# EAGLE schematic ControllerV6 (EAGLE 9.6.2)

## Sheet 1 of 2
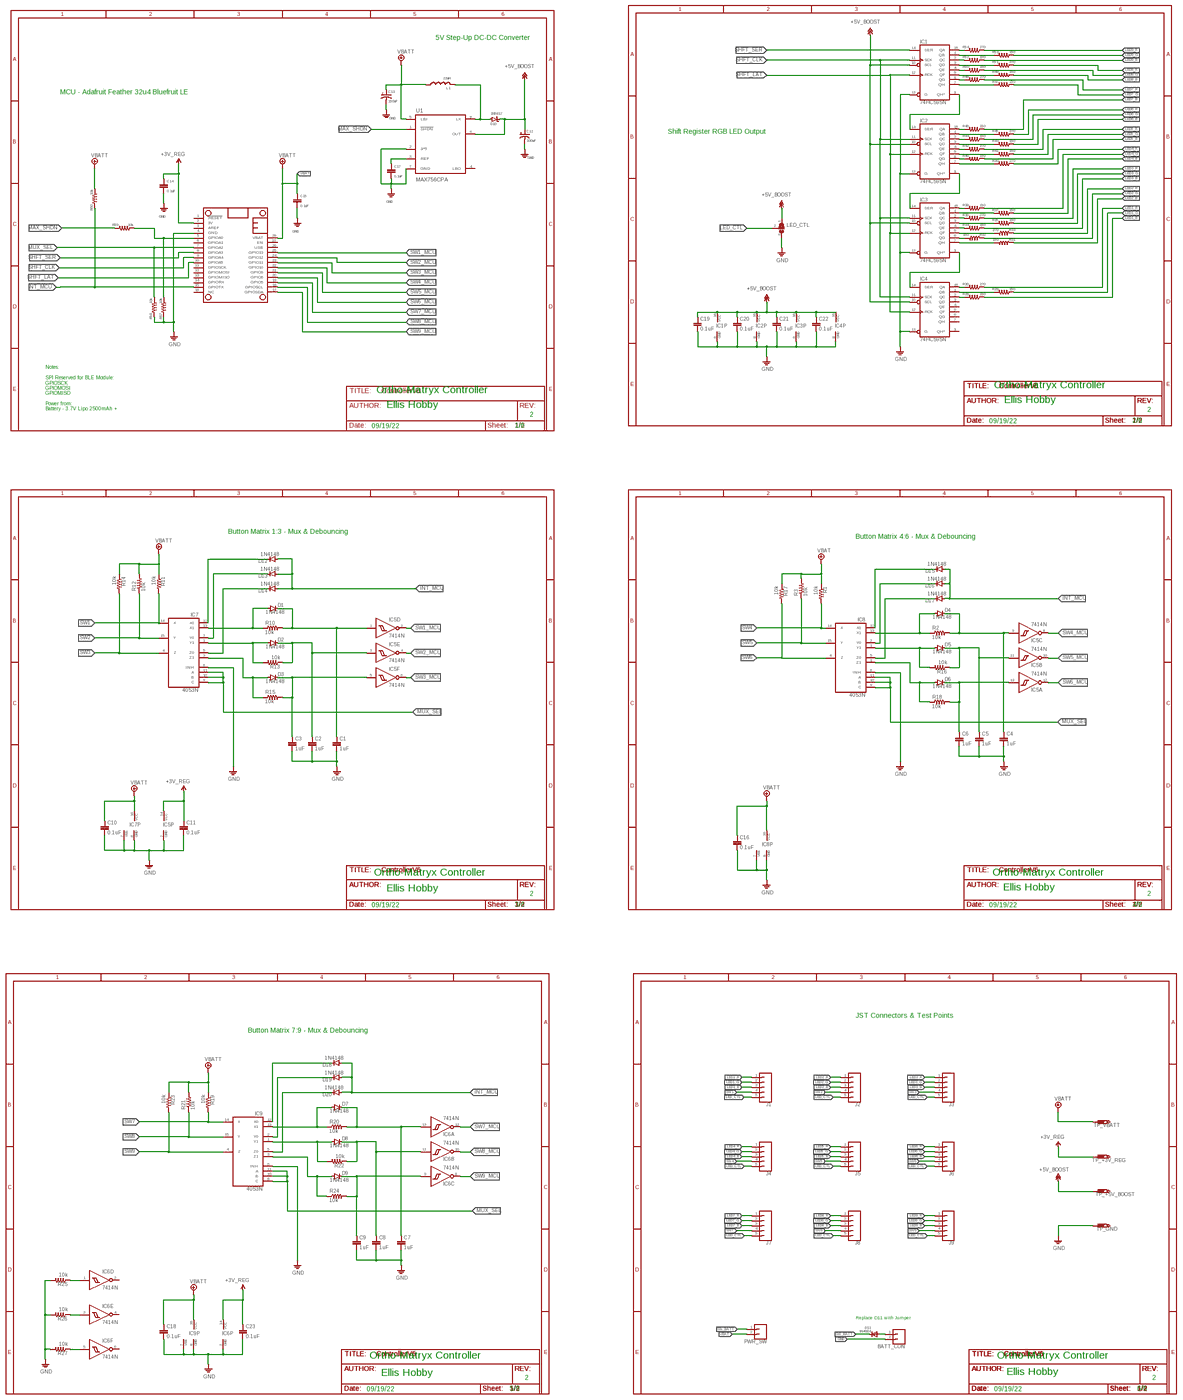
[diagram p0: schematic, sheet 1, overview]
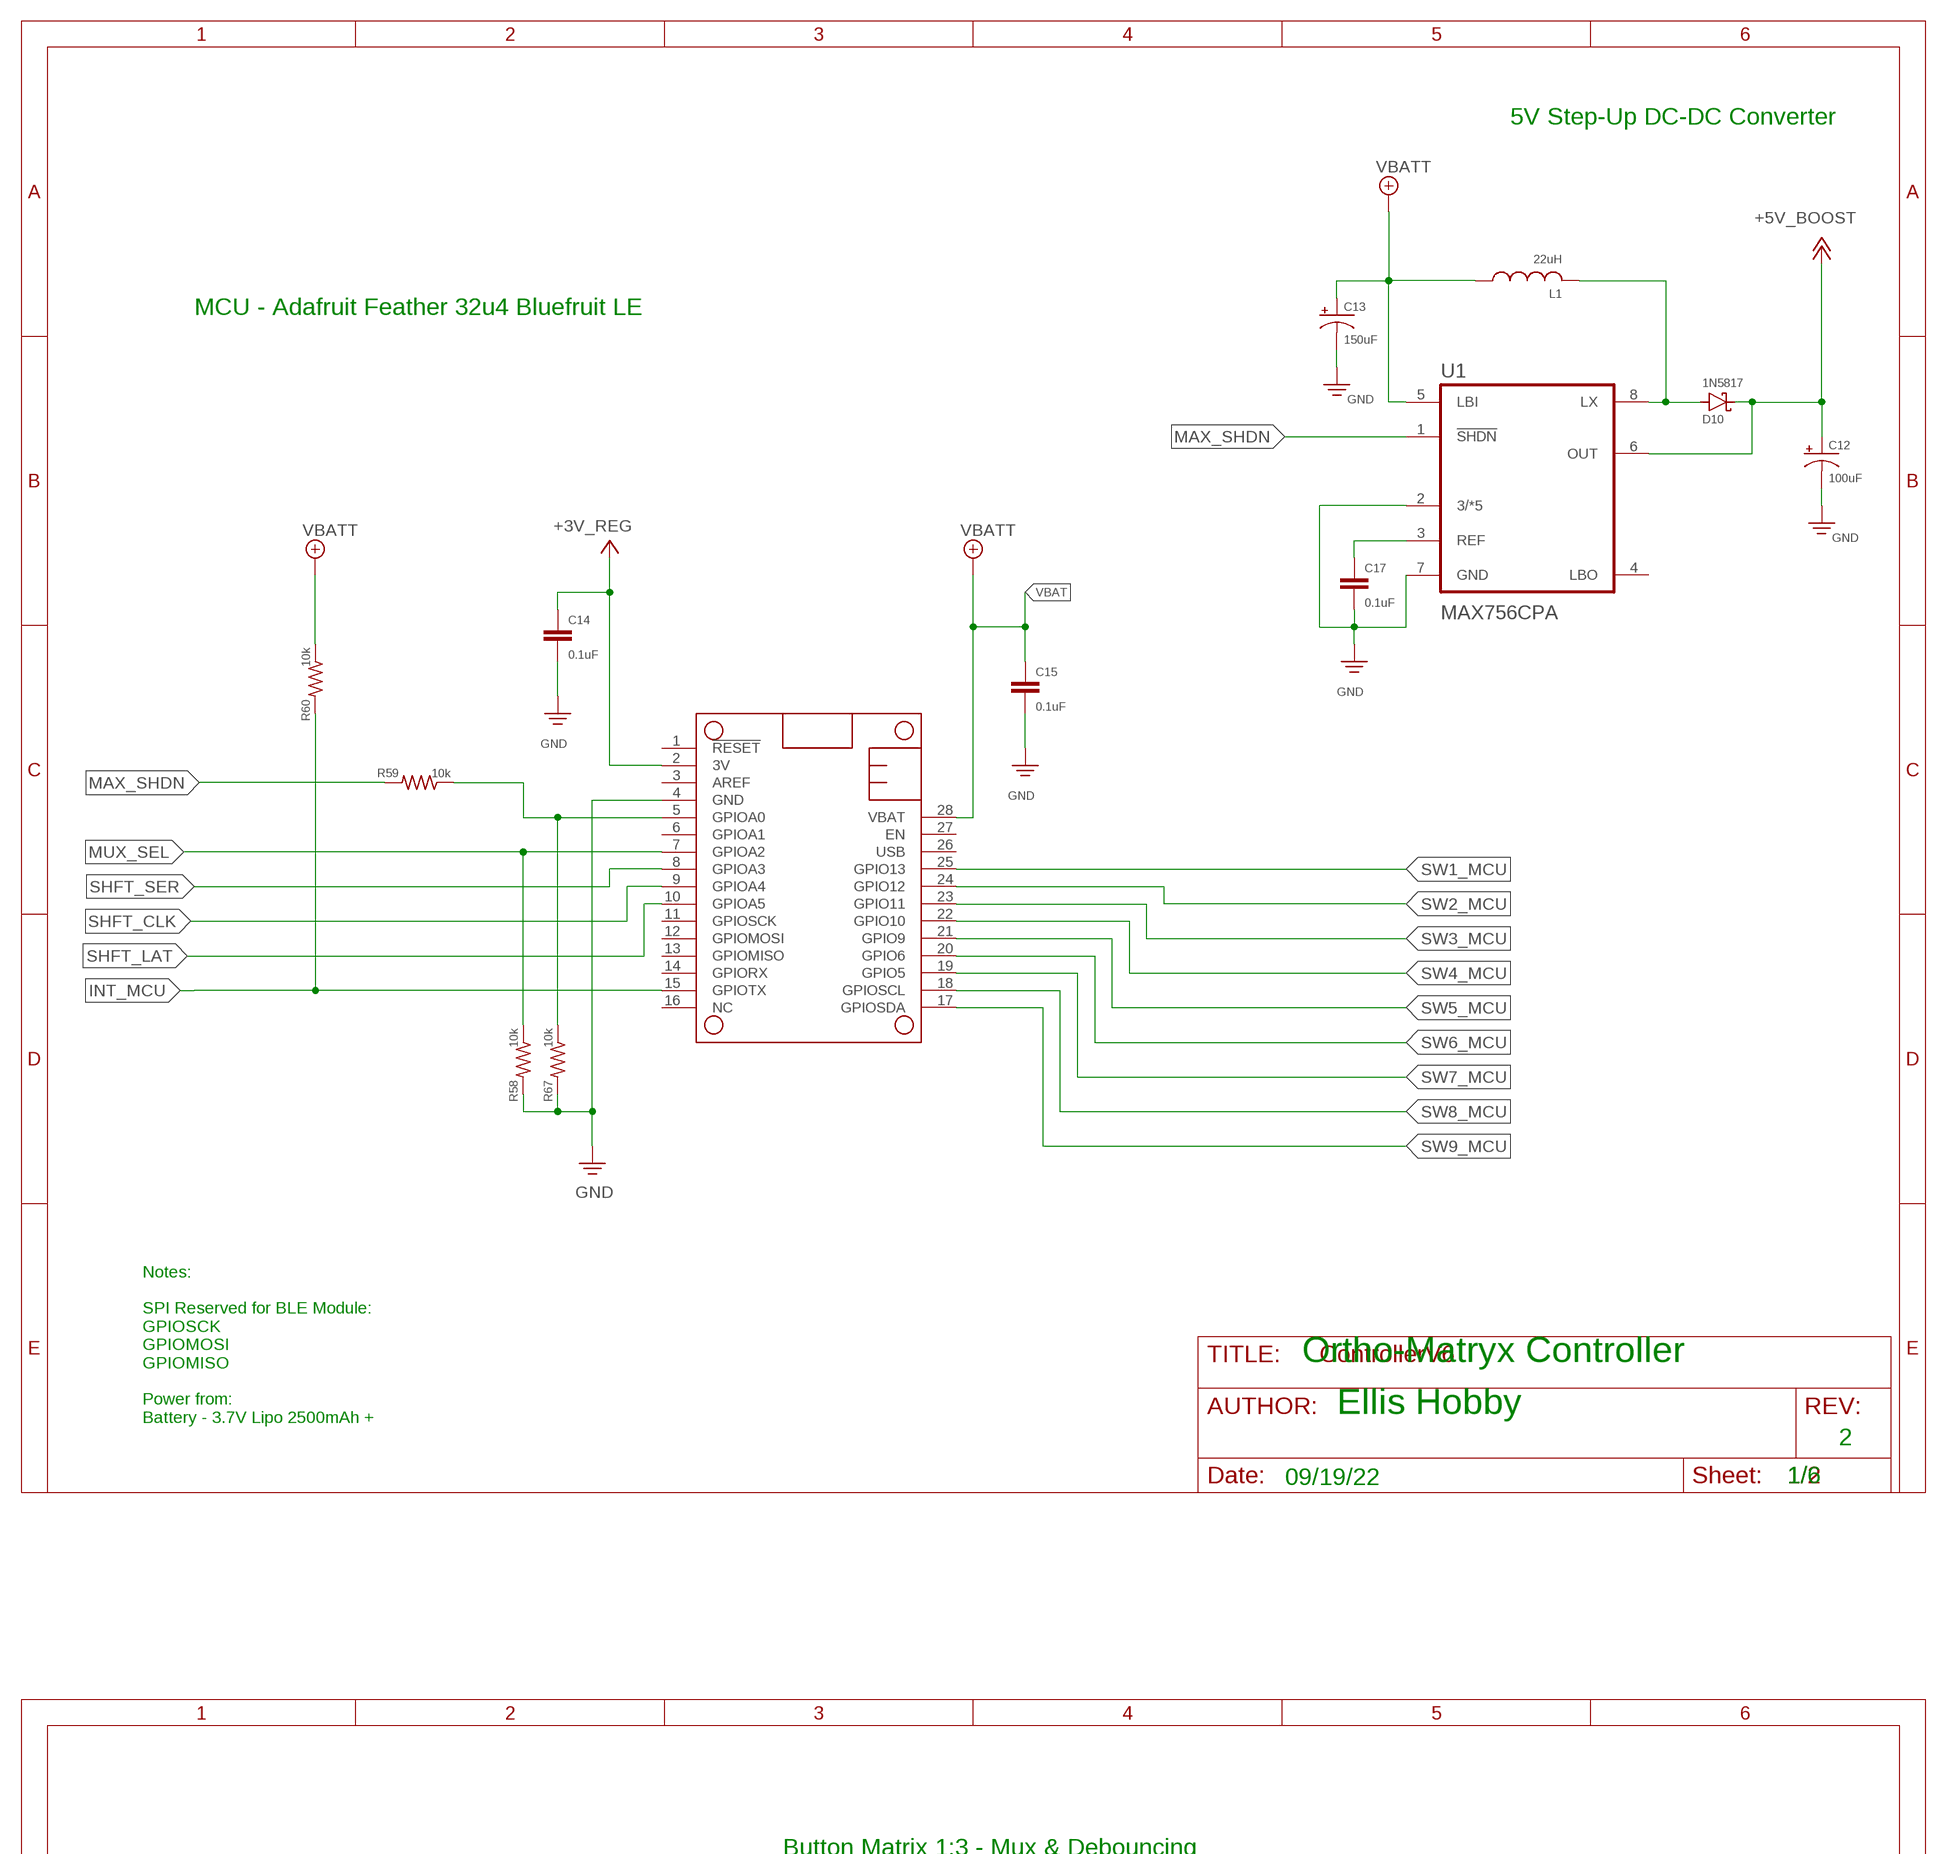
[diagram p1: schematic, sheet 1, part 1 of 4]
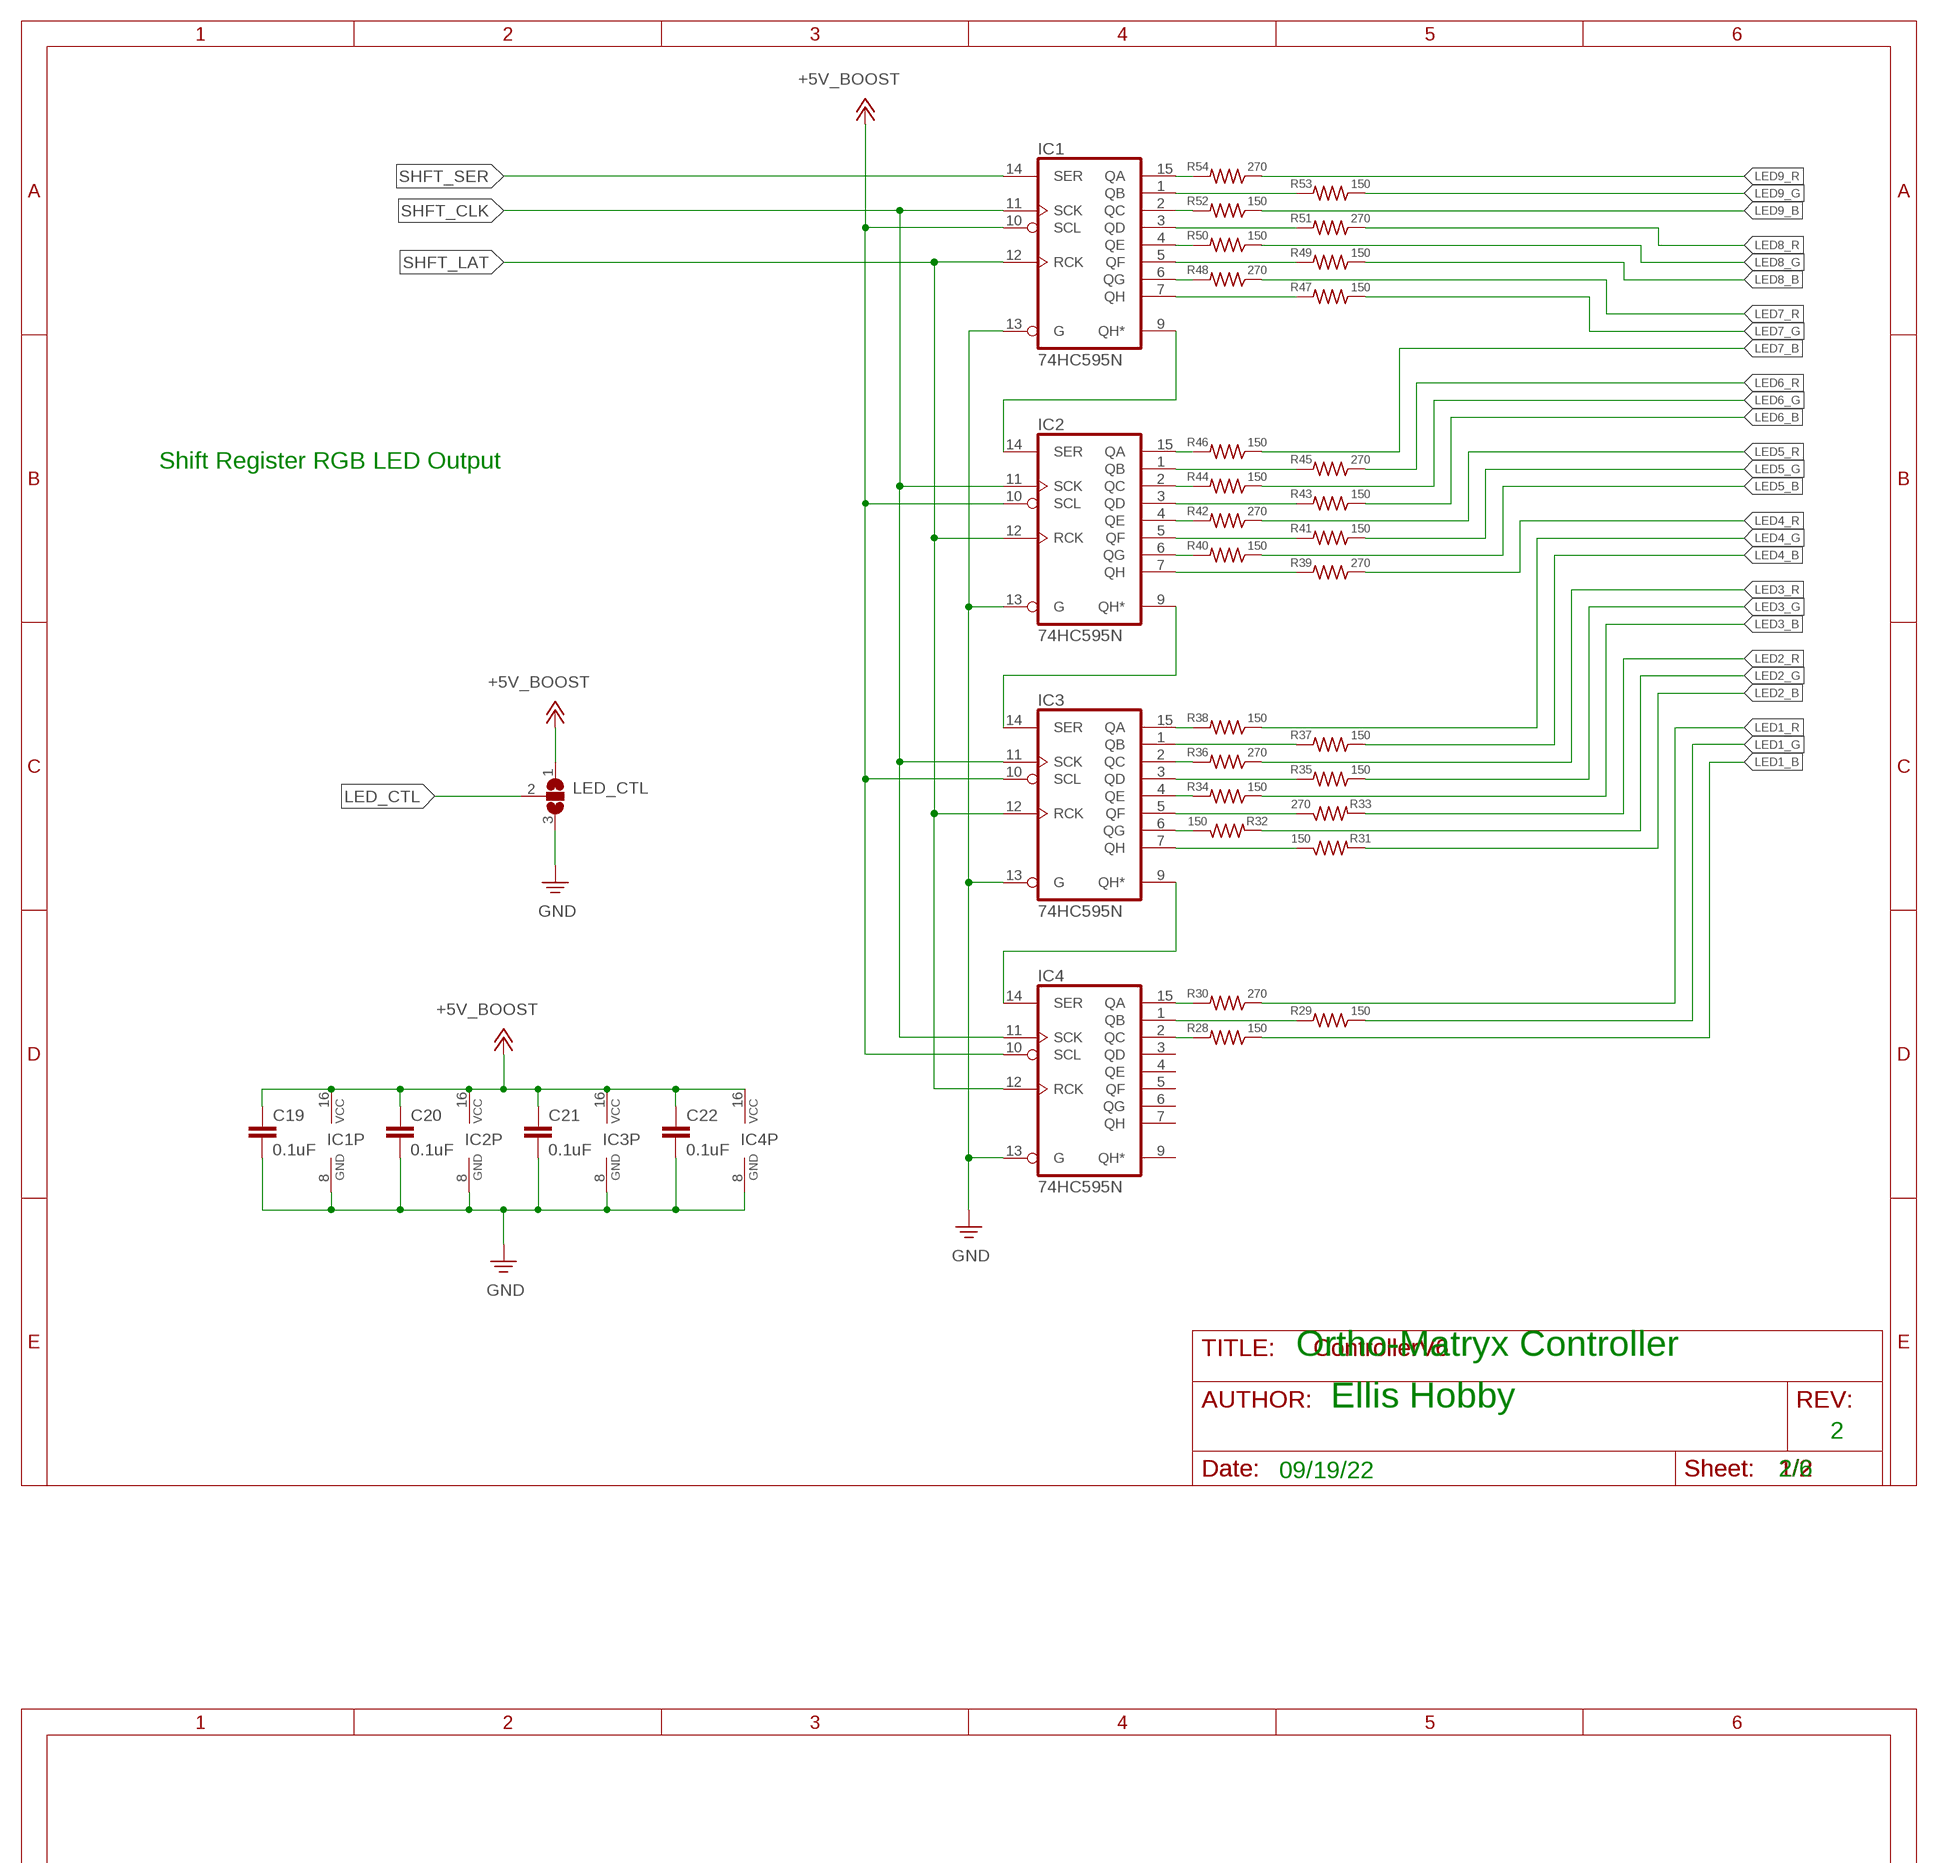
[diagram p2: schematic, sheet 1, part 2 of 4]
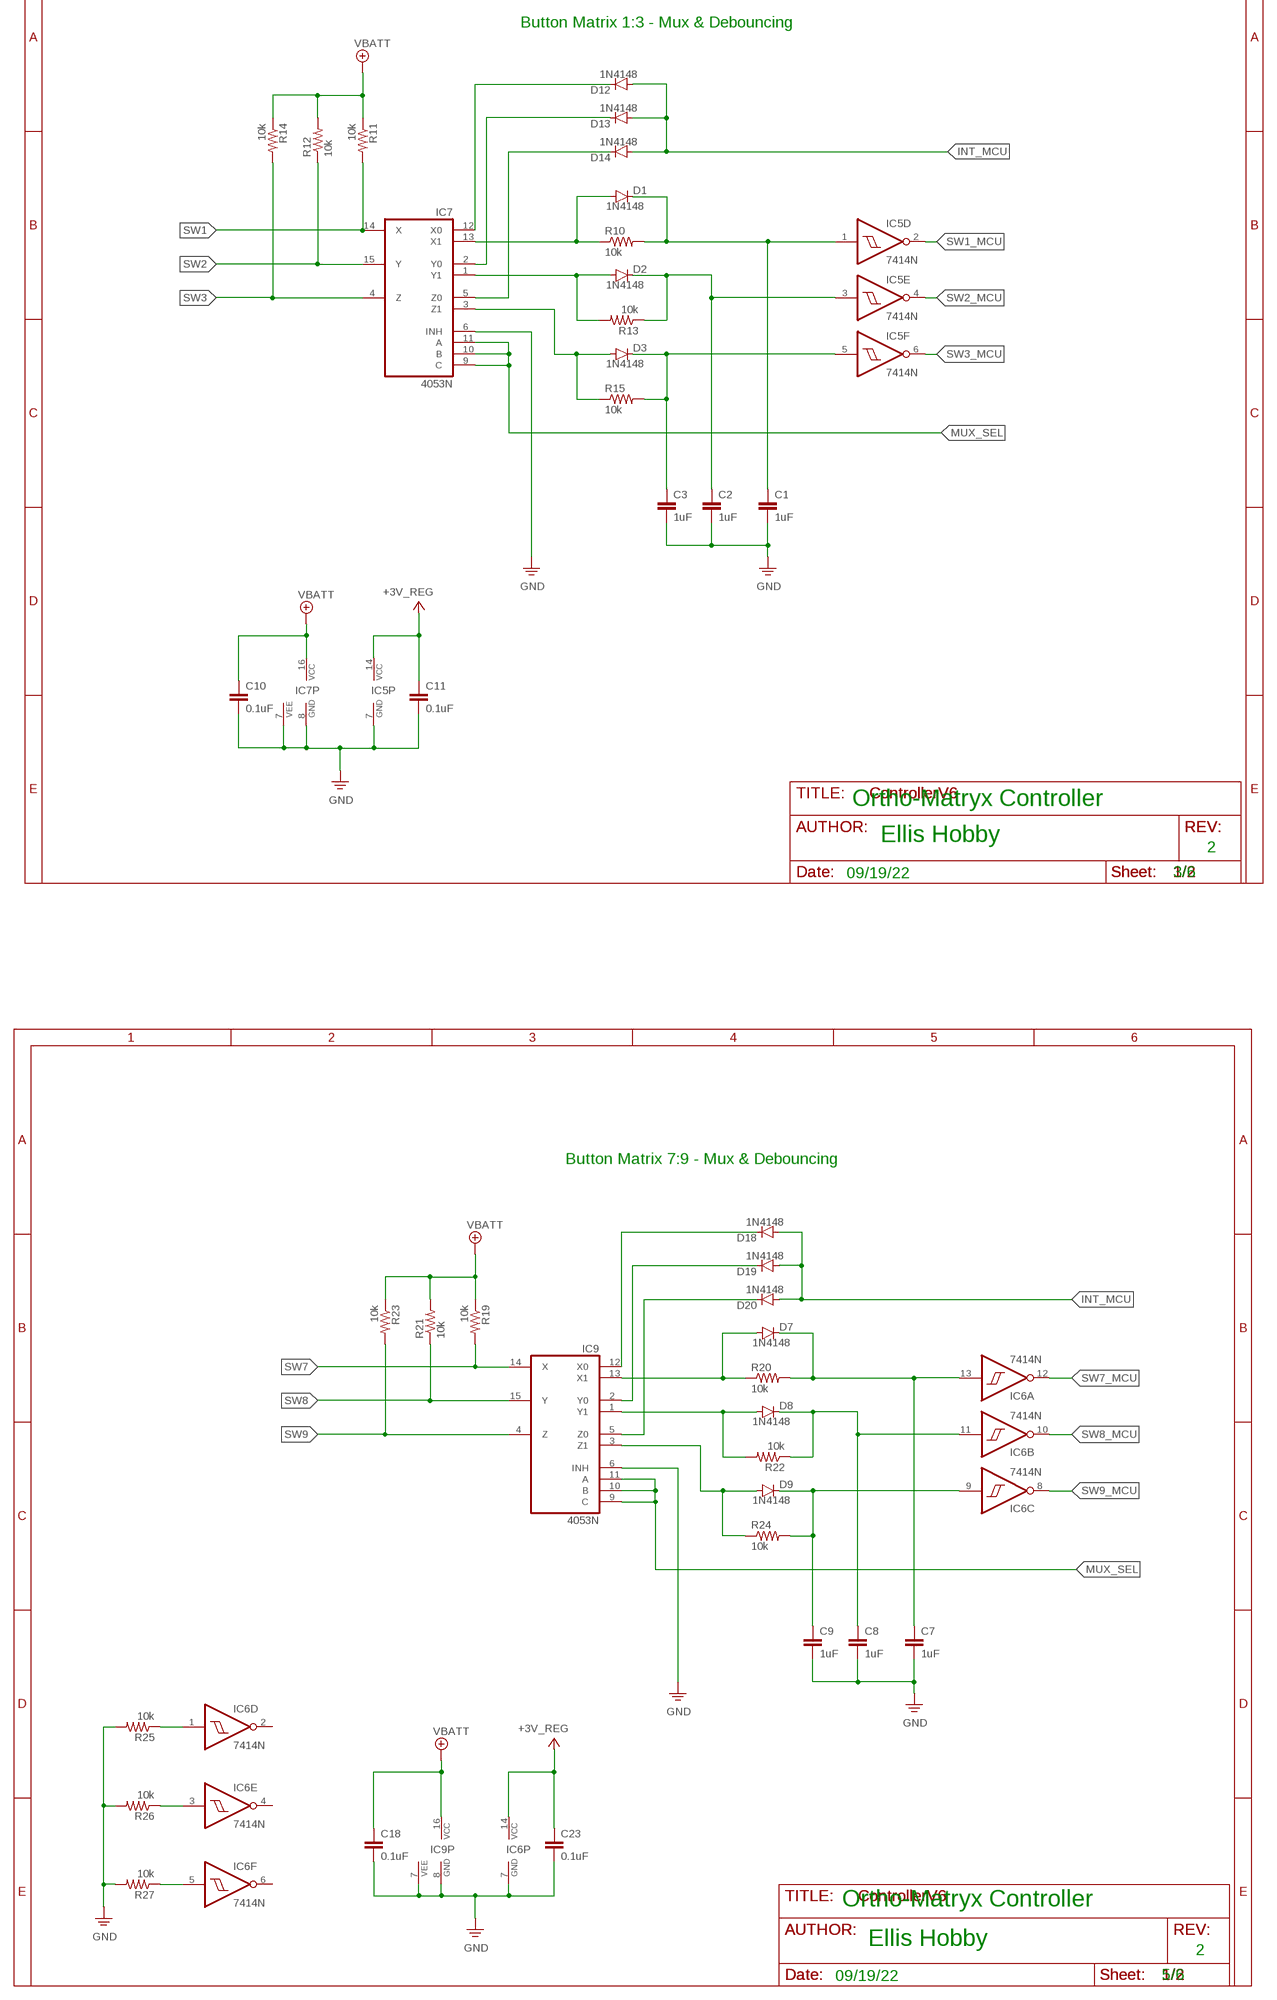
[diagram p3: schematic, sheet 1, part 3 of 4]
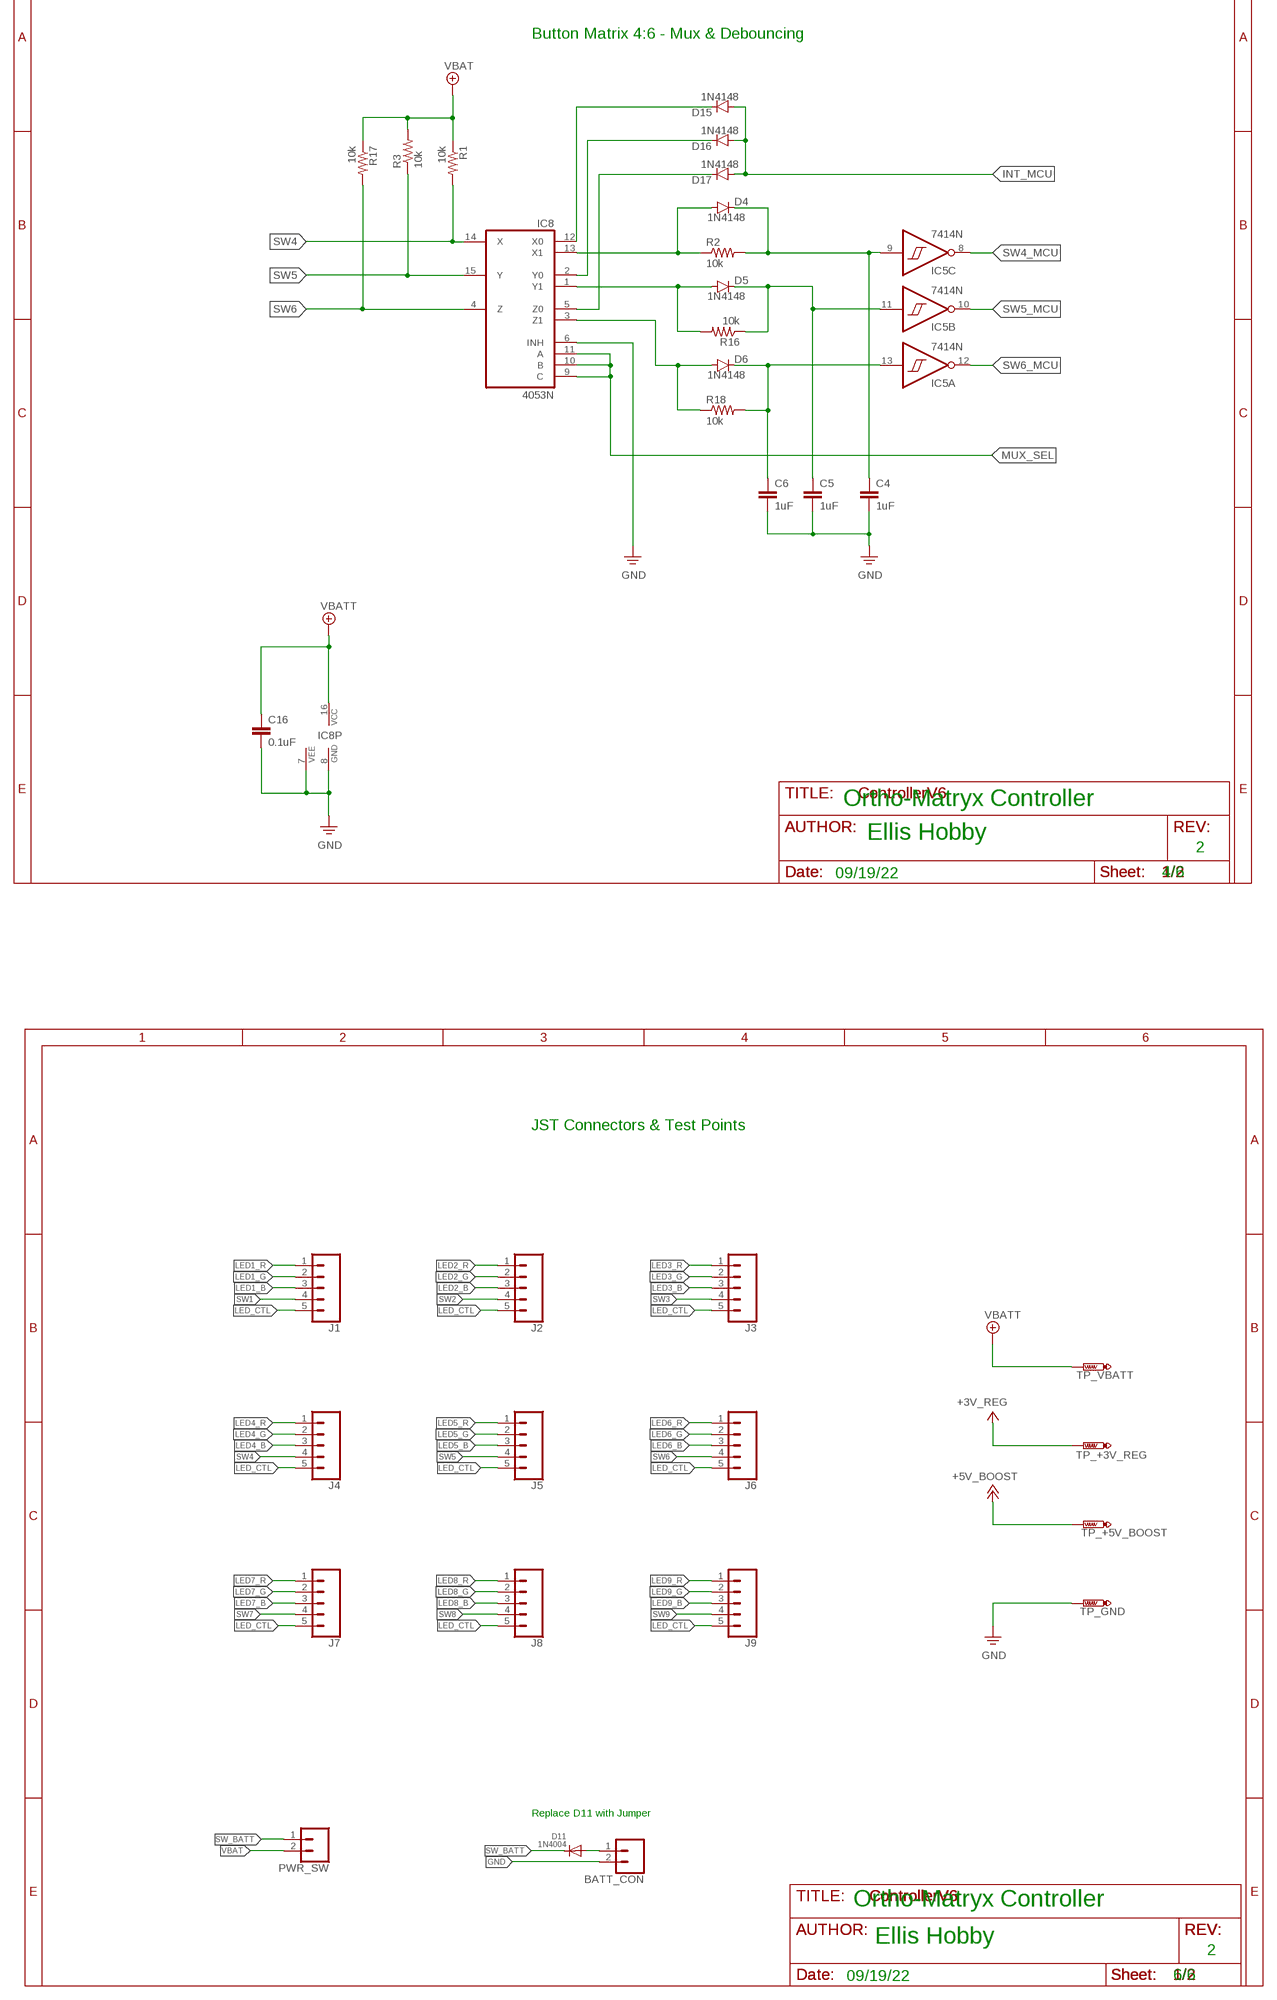
[diagram p4: schematic, sheet 1, part 4 of 4]

### Parts
BATT_CON  CONN_02POLAR  [MOLEX-1X2]
C1  1uF  C-EU025-025X050  [C025-025X050]
C2  1uF  C-EU025-025X050  [C025-025X050]
C3  1uF  C-EU025-025X050  [C025-025X050]
C4  1uF  C-EU025-025X050  [C025-025X050]
C5  1uF  C-EU025-025X050  [C025-025X050]
C6  1uF  C-EU025-025X050  [C025-025X050]
C7  1uF  C-EU025-025X050  [C025-025X050]
C8  1uF  C-EU025-025X050  [C025-025X050]
C9  1uF  C-EU025-025X050  [C025-025X050]
C10  0.1uF  C-EU025-025X050  [C025-025X050]
C11  0.1uF  C-EU025-025X050  [C025-025X050]
C12  100uF  CPOL-USE1.8-4  [E1,8-4]
C13  150uF  CPOL-USE1.8-4  [E1,8-4]
C14  0.1uF  C-EU025-025X050  [C025-025X050]
C15  0.1uF  C-EU025-025X050  [C025-025X050]
C16  0.1uF  C-EU025-025X050  [C025-025X050]
C17  0.1uF  C-EU025-025X050  [C025-025X050]
C18  0.1uF  C-EU025-025X050  [C025-025X050]
C19  0.1uF  C-EU025-025X050  [C025-025X050]
C20  0.1uF  C-EU025-025X050  [C025-025X050]
C21  0.1uF  C-EU025-025X050  [C025-025X050]
C22  0.1uF  C-EU025-025X050  [C025-025X050]
C23  0.1uF  C-EU025-025X050  [C025-025X050]
D1  1N4148  1N4148DO35-7  [DO35-7]
D2  1N4148  1N4148DO35-7  [DO35-7]
D3  1N4148  1N4148DO35-7  [DO35-7]
D4  1N4148  1N4148DO35-7  [DO35-7]
D5  1N4148  1N4148DO35-7  [DO35-7]
D6  1N4148  1N4148DO35-7  [DO35-7]
D7  1N4148  1N4148DO35-7  [DO35-7]
D8  1N4148  1N4148DO35-7  [DO35-7]
D9  1N4148  1N4148DO35-7  [DO35-7]
D10  1N5817  1N5817-B  [DO41-7.6]
D11  1N4004  [DO41-10]
D12  1N4148  1N4148DO35-7  [DO35-7]
D13  1N4148  1N4148DO35-7  [DO35-7]
D14  1N4148  1N4148DO35-7  [DO35-7]
D15  1N4148  1N4148DO35-7  [DO35-7]
D16  1N4148  1N4148DO35-7  [DO35-7]
D17  1N4148  1N4148DO35-7  [DO35-7]
D18  1N4148  1N4148DO35-7  [DO35-7]
D19  1N4148  1N4148DO35-7  [DO35-7]
D20  1N4148  1N4148DO35-7  [DO35-7]
IC1  74HC595N  [DIL16]
IC2  74HC595N  [DIL16]
IC3  74HC595N  [DIL16]
IC4  74HC595N  [DIL16]
IC5  7414N  [DIL14]
IC6  7414N  [DIL14]
IC7  4053N  [DIL16]
IC8  4053N  [DIL16]
IC9  4053N  [DIL16]
J1  CONN_05JST-VERT  [JST-5-PTH-VERT]
J2  CONN_05JST-VERT  [JST-5-PTH-VERT]
J3  CONN_05JST-VERT  [JST-5-PTH-VERT]
J4  CONN_05JST-VERT  [JST-5-PTH-VERT]
J5  CONN_05JST-VERT  [JST-5-PTH-VERT]
J6  CONN_05JST-VERT  [JST-5-PTH-VERT]
J7  CONN_05JST-VERT  [JST-5-PTH-VERT]
J8  CONN_05JST-VERT  [JST-5-PTH-VERT]
J9  CONN_05JST-VERT  [JST-5-PTH-VERT]
L1  22uH  L-US0204/5  [0204/5]
LED_CTL  SJ2WW  [SJ_2W]
MS2  FEATHERWING  [FEATHERWING]
PWR_SW  CONN_02POLAR  [MOLEX-1X2]
R1  10k  R-US_0204/5  [0204/5]
R2  10k  R-US_0204/5  [0204/5]
R3  10k  R-US_0204/5  [0204/5]
R10  10k  R-US_0204/5  [0204/5]
R11  10k  R-US_0204/5  [0204/5]
R12  10k  R-US_0204/5  [0204/5]
R13  10k  R-US_0204/5  [0204/5]
R14  10k  R-US_0204/5  [0204/5]
R15  10k  R-US_0204/5  [0204/5]
R16  10k  R-US_0204/5  [0204/5]
R17  10k  R-US_0204/5  [0204/5]
R18  10k  R-US_0204/5  [0204/5]
R19  10k  R-US_0204/5  [0204/5]
R20  10k  R-US_0204/5  [0204/5]
R21  10k  R-US_0204/5  [0204/5]
R22  10k  R-US_0204/5  [0204/5]
R23  10k  R-US_0204/5  [0204/5]
R24  10k  R-US_0204/5  [0204/5]
R25  10k  R-US_0204/5  [0204/5]
R26  10k  R-US_0204/5  [0204/5]
R27  10k  R-US_0204/5  [0204/5]
R28  150  R-US_0204/5  [0204/5]
R29  150  R-US_0204/5  [0204/5]
R30  270  R-US_0204/5  [0204/5]
R31  150  R-US_0204/5  [0204/5]
R32  150  R-US_0204/5  [0204/5]
R33  270  R-US_0204/5  [0204/5]
R34  150  R-US_0204/5  [0204/5]
R35  150  R-US_0204/5  [0204/5]
R36  270  R-US_0204/5  [0204/5]
R37  150  R-US_0204/5  [0204/5]
R38  150  R-US_0204/5  [0204/5]
R39  270  R-US_0204/5  [0204/5]
R40  150  R-US_0204/5  [0204/5]
R41  150  R-US_0204/5  [0204/5]
R42  270  R-US_0204/5  [0204/5]
R43  150  R-US_0204/5  [0204/5]
R44  150  R-US_0204/5  [0204/5]
R45  270  R-US_0204/5  [0204/5]
R46  150  R-US_0204/5  [0204/5]
R47  150  R-US_0204/5  [0204/5]
R48  270  R-US_0204/5  [0204/5]
R49  150  R-US_0204/5  [0204/5]
R50  150  R-US_0204/5  [0204/5]
R51  270  R-US_0204/5  [0204/5]
R52  150  R-US_0204/5  [0204/5]
R53  150  R-US_0204/5  [0204/5]
R54  270  R-US_0204/5  [0204/5]
R58  10k  R-US_0204/5  [0204/5]
R59  10k  R-US_0204/5  [0204/5]
R60  10k  R-US_0204/5  [0204/5]
R67  10k  R-US_0204/5  [0204/5]
TP_+3V_REG  PTR1PAD1-13Y  [P1-13Y]
TP_+5V_BOOST  PTR1PAD1-13Y  [P1-13Y]
TP_GND  PTR1PAD1-13Y  [P1-13Y]
TP_VBATT  PTR1PAD1-13Y  [P1-13Y]
U1  MAX756CPA  [DIP794W47P254L991H457Q8]

### Nets
+3V_REG: C11.1 C14.1 C23.1 IC5.14(P:VCC) IC6.14(P:VCC) MS2.2(3V) TP_+3V_REG.TP
+5V_BOOST: C12.+ C19.1 C20.1 C21.1 C22.1 D10.C IC1.10(SCL) IC1.16(VCC) IC2.10(SCL) IC2.16(VCC) IC3.10(SCL) IC3.16(VCC) IC4.10(SCL) IC4.16(VCC) LED_CTL.1 TP_+5V_BOOST.TP U1.6(OUT)
D1: C1.1 D1.C IC5.1(D:I) R10.2
D2: C2.1 D2.C IC5.3(E:I) R13.1
D3: C3.1 D3.C IC5.5(F:I) R15.2
D4: C4.1 D4.C IC5.9(C:I) R2.2
D5: C5.1 D5.C IC5.11(B:I) R16.1
D6: C6.1 D6.C IC5.13(A:I) R18.2
D7: C7.1 D7.C IC6.13(A:I) R20.2
D8: C8.1 D8.C IC6.11(B:I) R22.1
D9: C9.1 D9.C IC6.9(C:I) R24.2
GND: BATT_CON.2 C1.2 C2.2 C3.2 C4.2 C5.2 C6.2 C7.2 C8.2 C9.2 C10.2 C11.2 C12.- C13.- C14.2 C15.2 C16.2 C17.2 C18.2 C19.2 C20.2 C21.2 C22.2 C23.2 IC1.8(GND) IC1.13(G) IC2.8(GND) IC2.13(G) IC3.8(GND) IC3.13(G) IC4.8(GND) IC4.13(G) IC5.7(P:GND) IC6.7(P:GND) IC7.6(INH) IC7.7(VEE) IC7.8(GND) IC8.6(INH) IC8.7(VEE) IC8.8(GND) IC9.6(INH) IC9.7(VEE) IC9.8(GND) LED_CTL.3 MS2.4(GND) R25.2 R26.2 R27.2 R58.2 R67.2 TP_GND.TP U1.2(3/*5) U1.7(GND) ; supply symbol labelled PE
INT_MCU: D12.A D13.A D14.A D15.A D16.A D17.A D18.A D19.A D20.A MS2.15(GPIOTX) R60.2
LED1_B: J1.3 R28.1
LED1_G: J1.2 R29.1
LED1_R: J1.1 R30.1
LED2_B: J2.3 R31.2
LED2_G: J2.2 R32.2
LED2_R: J2.1 R33.2
LED3_B: J3.3 R34.1
LED3_G: J3.2 R35.1
LED3_R: J3.1 R36.1
LED4_B: J4.3 R37.1
LED4_G: J4.2 R38.1
LED4_R: J4.1 R39.1
LED5_B: J5.3 R40.1
LED5_G: J5.2 R41.1
LED5_R: J5.1 R42.1
LED6_B: J6.3 R43.1
LED6_G: J6.2 R44.1
LED6_R: J6.1 R45.1
LED7_B: J7.3 R46.1
LED7_G: J7.2 R47.1
LED7_R: J7.1 R48.1
LED8_B: J8.3 R49.1
LED8_G: J8.2 R50.1
LED8_R: J8.1 R51.1
LED9_B: J9.3 R52.1
LED9_G: J9.2 R53.1
LED9_R: J9.1 R54.1
LED_CTL: J1.5 J2.5 J3.5 J4.5 J5.5 J6.5 J7.5 J8.5 J9.5 LED_CTL.2
MAX_SHDN: R59.2 U1.1(!SHDN)
MUX_SEL: IC7.9(C) IC7.10(B) IC7.11(A) IC8.9(C) IC8.10(B) IC8.11(A) IC9.9(C) IC9.10(B) IC9.11(A) MS2.7(GPIOA2) R58.1
N$1: IC4.15(QA) R30.2
N$2: IC4.1(QB) R29.2
N$3: BATT_CON.1 D11.A
N$4: D1.A IC7.13(X1) R10.1
N$5: C17.1 U1.3(REF)
N$9: D13.C IC7.2(Y0)
N$10: D14.C IC7.5(Z0)
N$11: D2.A IC7.1(Y1) R13.2
N$12: D16.C IC8.2(Y0)
N$13: D12.C IC7.12(X0)
N$14: D3.A IC7.3(Z1) R15.1
N$15: D17.C IC8.5(Z0)
N$16: D4.A IC8.13(X1) R2.1
N$17: IC1.9(QH*) IC2.14(SER)
N$18: IC2.9(QH*) IC3.14(SER)
N$19: D5.A IC8.1(Y1) R16.2
N$20: D15.C IC8.12(X0)
N$21: D6.A IC8.3(Z1) R18.1
N$22: D7.A IC9.13(X1) R20.1
N$23: D8.A IC9.1(Y1) R22.2
N$24: D9.A IC9.3(Z1) R24.1
N$25: D18.C IC9.12(X0)
N$26: D19.C IC9.2(Y0)
N$27: D20.C IC9.5(Z0)
N$28: IC4.2(QC) R28.2
N$29: IC1.15(QA) R54.2
N$30: IC3.9(QH*) IC4.14(SER)
N$31: IC1.1(QB) R53.2
N$32: IC1.2(QC) R52.2
N$33: IC3.5(QF) R33.1
N$34: IC3.6(QG) R32.1
N$35: IC3.7(QH) R31.1
N$36: MS2.5(GPIOA0) R59.1 R67.1
N$37: IC1.3(QD) R51.2
N$38: IC1.4(QE) R50.2
N$39: IC1.5(QF) R49.2
N$40: IC3.4(QE) R34.2
N$41: IC3.2(QC) R36.2
N$42: IC3.3(QD) R35.2
N$43: IC1.6(QG) R48.2
N$44: IC1.7(QH) R47.2
N$45: IC2.15(QA) R46.2
N$46: IC2.1(QB) R45.2
N$47: IC2.2(QC) R44.2
N$48: IC2.3(QD) R43.2
N$49: IC2.4(QE) R42.2
N$50: IC2.6(QG) R40.2
N$51: IC2.7(QH) R39.2
N$52: IC3.15(QA) R38.2
N$53: IC3.1(QB) R37.2
N$64: IC2.5(QF) R41.2
N$78: IC6.1(D:I) R25.1
N$79: IC6.3(E:I) R26.1
N$80: IC6.5(F:I) R27.1
N$83: D10.A L1.2 U1.8(LX)
SHFT_CLK: IC1.11(SCK) IC2.11(SCK) IC3.11(SCK) IC4.11(SCK) MS2.9(GPIOA4)
SHFT_LAT: IC1.12(RCK) IC2.12(RCK) IC3.12(RCK) IC4.12(RCK) MS2.10(GPIOA5)
SHFT_SER: IC1.14(SER) MS2.8(GPIOA3)
SW1: IC7.14(X) J1.4 R11.2
SW1_MCU: IC5.2(D:O) MS2.25(GPIO13)
SW2: IC7.15(Y) J2.4 R12.1
SW2_MCU: IC5.4(E:O) MS2.24(GPIO12)
SW3: IC7.4(Z) J3.4 R14.2
SW3_MCU: IC5.6(F:O) MS2.23(GPIO11)
SW4: IC8.14(X) J4.4 R1.2
SW4_MCU: IC5.8(C:O) MS2.22(GPIO10)
SW5: IC8.15(Y) J5.4 R3.1
SW5_MCU: IC5.10(B:O) MS2.21(GPIO9)
SW6: IC8.4(Z) J6.4 R17.2
SW6_MCU: IC5.12(A:O) MS2.20(GPIO6)
SW7: IC9.14(X) J7.4 R19.2
SW7_MCU: IC6.12(A:O) MS2.19(GPIO5)
SW8: IC9.15(Y) J8.4 R21.1
SW8_MCU: IC6.10(B:O) MS2.18(GPIOSCL)
SW9: IC9.4(Z) J9.4 R23.2
SW9_MCU: IC6.8(C:O) MS2.17(GPIOSDA)
SW_BATT: D11.C PWR_SW.1
VBAT: C10.1 C13.+ C15.1 C16.1 C18.1 IC7.16(VCC) IC8.16(VCC) IC9.16(VCC) L1.1 MS2.28(VBAT) PWR_SW.2 R1.1 R3.2 R11.1 R12.2 R14.1 R17.1 R19.1 R21.2 R23.1 R60.1 TP_VBATT.TP U1.5(LBI) ; supply symbol labelled VBATT
Unconnected: IC4.3(QD) IC4.4(QE) IC4.5(QF) IC4.6(QG) IC4.7(QH) IC4.9(QH*) IC6.2(D:O) IC6.4(E:O) IC6.6(F:O) MS2.1(!RESET) MS2.3(AREF) MS2.6(GPIOA1) MS2.11(GPIOSCK) MS2.12(GPIOMOSI) MS2.13(GPIOMISO) MS2.14(GPIORX) MS2.16(NC) MS2.26(USB) MS2.27(EN) U1.4(LBO)

### Notes on the sheet
- 5V Step-Up DC-DC Converter
- MCU - Adafruit Feather 32u4 Bluefruit LE
- Shift Register RGB LED Output
- Ortho-Matryx Controller
- Ortho-Matryx Controller
- Ellis Hobby
- Ellis Hobby
- Notes:
  
  SPI Reserved for BLE Module:
  GPIOSCK
  GPIOMOSI
  GPIOMISO
  
  Power from:
  Battery - 3.7V Lipo 2500mAh +
- 2
- 2
- 09/19/22 | 2/6
- 09/19/22 | 1/6
- Button Matrix 1:3 - Mux & Debouncing
- Button Matrix 4:6 - Mux & Debouncing
- Ortho-Matryx Controller | Ortho-Matryx Controller
- Ellis Hobby | Ellis Hobby
- 2 | 2
- 09/19/22 | 3/6 | 09/19/22 | 4/6
- JST Connectors & Test Points
- Button Matrix 7:9 - Mux & Debouncing
- Replace D11 with Jumper
- Ortho-Matryx Controller | Ortho-Matryx Controller
- Ellis Hobby | Ellis Hobby
- 2 | 2
- 09/19/22 | 5/6 | 09/19/22 | 6/6

## Sheet 2 of 2

## Library data of the parts
BATT_CON PWR_SW = SparkFun-Connectors:CONN_02: Multi connection point. Often used as Generic Header-pin footprint for 0.1 inch spaced/style header connections On any of the 0.1 inch spaced packages, you can populate with these: Break Away Headers - Straight <https://www.sparkfun.com/products/116> (PRT-00116) Break Away Male Headers - Right Angle <https://www.sparkfun.com/products/553> (PRT-00553) Female Headers <https://www.sparkfun.com/products/115> (PRT-00115) Break Away Headers - Machine Pin <https://www.sparkfun.com/products/117> (PRT-00117) Break Away Female Headers - Swiss Machine Pin <https://www.sparkfun.com/products/743> (PRT-00743) For SCREWTERMINALS and SPRING TERMINALS visit here: Screw Terimnals on SparkFun.com <https://www.sparkfun.com/search/results?term=Screw+Terminals> (5mm/3.5mm/2.54mm spacing) This device is also useful as a general connection point to wire up your design to another part of your project. Our various solder wires solder well into these plated through hole pads. Hook-Up Wire - Assortment (Stranded, 22 AWG) <https://www.sparkfun.com/products/11375> (PRT-11375) Hook-Up Wire - Assortment (Solid Core, 22 AWG) <https://www.sparkfun.com/products/11367> (PRT-11367) View the entire wire category on our website here <https://www.sparkfun.com/categories/141> Special notes: Molex polarized connector foot print use with: PRT-08233 with associated crimp pins and housings. 2.54_SCREWTERM for use with PRT-10571. 3.5mm Screw Terminal footprints for PRT-08084 5mm Screw Terminal footprints for use with PRT-08432; SF_ID: PRT-09918
C1-C11 C14-C23 = rcl:C-EU: CAPACITOR, European symbol; SPICEPREFIX: C
C12 C13 = rcl:CPOL-US: POLARIZED CAPACITOR, American symbol; SPICEPREFIX: C
D1-D9 D12-D20 = diode:1N4148: DIODE high speed (Philips)
D10 = diode:1N581*: 1.0A SCHOTTKY BARRIER RECTIFIER Source: http://www.diodes.com/datasheets/ds23001.pdf
D11 = adafruit:1N4004: DIODE General purpose 1N400x type rectifier (With bigger pads) http://www.ladyada.net/library/pcb/eaglelibrary.html
IC1-IC4 = 74xx-eu:74*595: 8-bit SHIFT REGISTER, output latch
IC5 IC6 = 74xx-eu:74*14: Hex schmitt trigger INVERTER
IC7-IC9 = 40xx:4053: Triple 2-channel ANALOG MULTIPLEXER
J1-J9 = SparkFun-Connectors:CONN_05: Multi connection point. Often used as Generic Header-pin footprint for 0.1 inch spaced/style header connections On any of the 0.1 inch spaced packages, you can populate with these: Break Away Headers - Straight <https://www.sparkfun.com/products/116> (PRT-00116) Break Away Male Headers - Right Angle <https://www.sparkfun.com/products/553> (PRT-00553) Female Headers <https://www.sparkfun.com/products/115> (PRT-00115) Break Away Headers - Machine Pin <https://www.sparkfun.com/products/117> (PRT-00117) Break Away Female Headers - Swiss Machine Pin <https://www.sparkfun.com/products/743> (PRT-00743) For SCREWTERMINALS and SPRING TERMINALS visit here: Screw Terimnals on SparkFun.com <https://www.sparkfun.com/search/results?term=Screw+Terminals> (5mm/3.5mm/2.54mm spacing) This device is also useful as a general connection point to wire up your design to another part of your project. Our various solder wires solder well into these plated through hole pads. Hook-Up Wire - Assortment (Stranded, 22 AWG) <https://www.sparkfun.com/products/11375> (PRT-11375) Hook-Up Wire - Assortment (Solid Core, 22 AWG) <https://www.sparkfun.com/products/11367> (PRT-11367) View the entire wire category on our website here <https://www.sparkfun.com/categories/141> Special notes: Molex polarized connector foot print use with SKU : PRT-08231 with associated crimp pins and housings. 1MM SMD Version SKU: PRT-10208
L1 = rcl:L-US: INDUCTOR, American symbol; SPICEPREFIX: L
LED_CTL = jumper:SJ2W: SMD solder JUMPER
MS2 = adafruit:FEATHERWING
R1-R3 R10-R54 R58-R60 R67 = rcl:R-US_: RESISTOR, American symbol; SPICEPREFIX: R
TP_+3V_REG TP_+5V_BOOST TP_GND TP_VBATT = testpad:PTR1: TEST PIN
U1 = MAX756CPA:MAX756CPA: Check availability <https://pricing.snapeda.com/parts/MAX756CPA/Maxim%20Integrated/view-part?ref=eda>; AVAILABILITY: In Stock; DESCRIPTION: Boost Switching Regulator IC Positive Programmable 3.3V, 5V 1 Output - 8-DIP (0.300, 7.62mm); MF: Maxim Integrated; MP: MAX756CPA; PACKAGE: DIP-8 Maxim Integrated; PRICE: None; PURCHASE-URL: https://pricing.snapeda.com/search/part/MAX756CPA/?ref=eda